# Altium project 8Port_Ethernet.PrjPcb
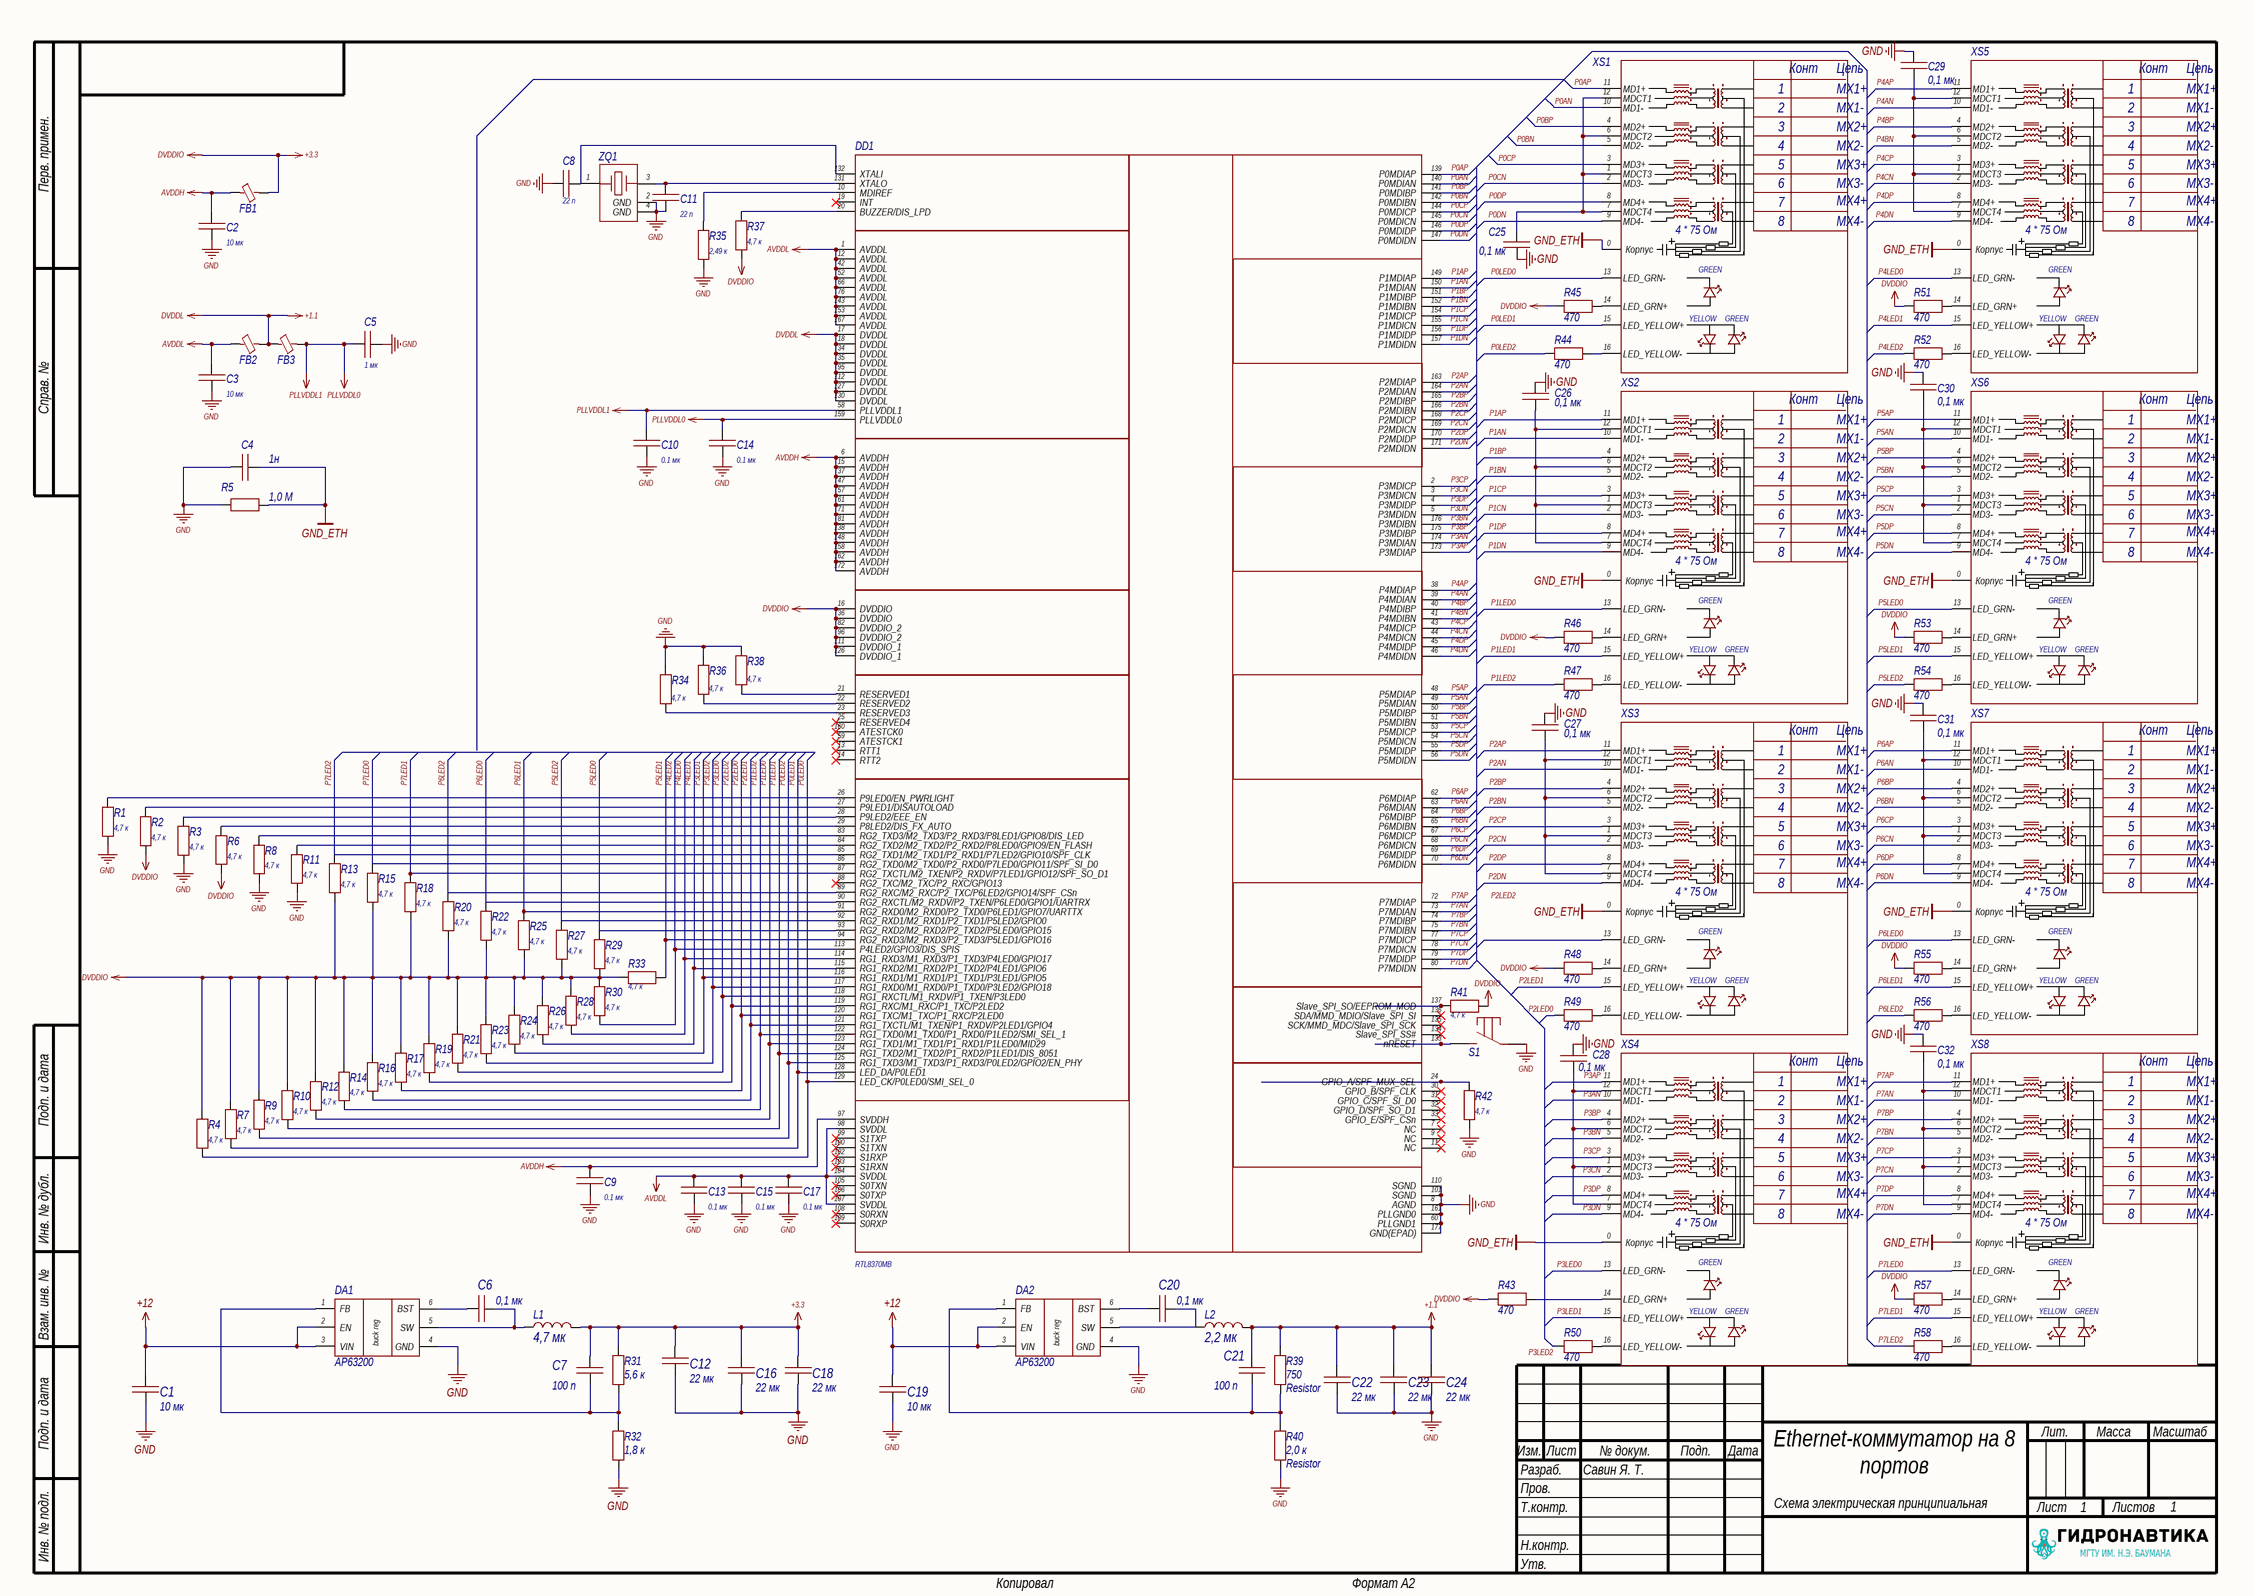
[diagram p0: 8Port.SchDoc]
1 sheet, 108 parts. Net scope: global (net labels, ports and power ports of the same name join across sheets).

## Sheet 8Port.SchDoc: Ethernet-коммутатор на 8 портов
size 594 x 420 mm; DrawnBy: Савин Я. Т.; Address1: Address1; Address2: Address2; Address3: Address3; Address4: Address4; SheetNumber: 1; SheetTotal: 1

### Parts
C1  value 10 мк  [1210C]  (hidden comment: Capacitor)
C2  value 10 мк  [0603C]  (hidden comment: Capacitor)
C3  value 10 мк  [0603C]  (hidden comment: Capacitor)
C4  value 1н  [1210C]  (hidden comment: Capacitor)
C5  value 1 мк  [0603C]  (hidden comment: Capacitor)
C6  value 0,1 мк  [0603C]  (hidden comment: Capacitor)
C7  value 100 п  [0603C]  (hidden comment: Capacitor)
C8  value 22 п  [0603C]  (hidden comment: Capacitor)
C9  value 0.1 мк  [0603C]  (hidden comment: Capacitor)
C10  value 0.1 мк  [0603C]  (hidden comment: Capacitor)
C11  value 22 п  [0603C]  (hidden comment: Capacitor)
C12  value 22 мк  [1210C]  (hidden comment: Capacitor)
C13  value 0.1 мк  [0603C]  (hidden comment: Capacitor)
C14  value 0.1 мк  [0603C]  (hidden comment: Capacitor)
C15  value 0.1 мк  [0603C]  (hidden comment: Capacitor)
C16  value 22 мк  [1210C]  (hidden comment: Capacitor)
C17  value 0.1 мк  [0603C]  (hidden comment: Capacitor)
C18  value 22 мк  [1210C]  (hidden comment: Capacitor)
C19  value 10 мк  [1210C]  (hidden comment: Capacitor)
C20  value 0,1 мк  [0603C]  (hidden comment: Capacitor)
C21  value 100 п  [0603C]  (hidden comment: Capacitor)
C22  value 22 мк  [1210C]  (hidden comment: Capacitor)
C23  value 22 мк  [1210C]  (hidden comment: Capacitor)
C24  value 22 мк  [1210C]  (hidden comment: Capacitor)
C25  value 0,1 мк  [0603C]  (hidden comment: Capacitor)
C26  value 0,1 мк  [0603C]  (hidden comment: Capacitor)
C27  value 0,1 мк  [0603C]  (hidden comment: Capacitor)
C28  value 0,1 мк  [0603C]  (hidden comment: Capacitor)
C29  value 0,1 мк  [0603C]  (hidden comment: Capacitor)
C30  value 0,1 мк  [0603C]  (hidden comment: Capacitor)
C31  value 0,1 мк  [0603C]  (hidden comment: Capacitor)
C32  value 0,1 мк  [0603C]  (hidden comment: Capacitor)
DA1  AP63200  [TSOT26]
DA2  AP63200  [TSOT26]
DD1  RTL8370MB  [QFP40P2200X2200X120-177N]
FB1  BLM18AG102SN1D  [0603L]  (value not drawn)
FB2  BLM18AG102SN1D  [0603L]  (value not drawn)
FB3  BLM18AG102SN1D  [0603L]  (value not drawn)
L1  value 4,7 мк  [B82462G4]  (hidden comment: B82472G6472M)
L2  value 2,2 мк  [CDRH6D12]  (hidden comment: CDRH6D12NP-2R2NC)
R1  value 4,7 к  [0603R]  (hidden comment: Resistor)
R2  value 4,7 к  [0603R]  (hidden comment: Resistor)
R3  value 4,7 к  [0603R]  (hidden comment: Resistor)
R4  value 4,7 к  [0603R]  (hidden comment: Resistor)
R5  value 1,0 М  [0603R]  (hidden comment: Resistor)
R6  value 4,7 к  [0603R]  (hidden comment: Resistor)
R7  value 4,7 к  [0603R]  (hidden comment: Resistor)
R8  value 4,7 к  [0603R]  (hidden comment: Resistor)
R9  value 4,7 к  [0603R]  (hidden comment: Resistor)
R10  value 4,7 к  [0603R]  (hidden comment: Resistor)
R11  value 4,7 к  [0603R]  (hidden comment: Resistor)
R12  value 4,7 к  [0603R]  (hidden comment: Resistor)
R13  value 4,7 к  [0603R]  (hidden comment: Resistor)
R14  value 4,7 к  [0603R]  (hidden comment: Resistor)
R15  value 4,7 к  [0603R]  (hidden comment: Resistor)
R16  value 4,7 к  [0603R]  (hidden comment: Resistor)
R17  value 4,7 к  [0603R]  (hidden comment: Resistor)
R18  value 4,7 к  [0603R]  (hidden comment: Resistor)
R19  value 4,7 к  [0603R]  (hidden comment: Resistor)
R20  value 4,7 к  [0603R]  (hidden comment: Resistor)
R21  value 4,7 к  [0603R]  (hidden comment: Resistor)
R22  value 4,7 к  [0603R]  (hidden comment: Resistor)
R23  value 4,7 к  [0603R]  (hidden comment: Resistor)
R24  value 4,7 к  [0603R]  (hidden comment: Resistor)
R25  value 4,7 к  [0603R]  (hidden comment: Resistor)
R26  value 4,7 к  [0603R]  (hidden comment: Resistor)
R27  value 4,7 к  [0603R]  (hidden comment: Resistor)
R28  value 4,7 к  [0603R]  (hidden comment: Resistor)
R29  value 4,7 к  [0603R]  (hidden comment: Resistor)
R30  value 4,7 к  [0603R]  (hidden comment: Resistor)
R31  value 5,6 к  [0603R]  (hidden comment: Resistor)
R32  value 1,8 к  [0603R]  (hidden comment: Resistor)
R33  value 4,7 к  [0603R]  (hidden comment: Resistor)
R34  value 4,7 к  [0603R]  (hidden comment: Resistor)
R35  value 2,49 к  [0603R]  (hidden comment: Resistor)
R36  value 4,7 к  [0603R]  (hidden comment: Resistor)
R37  value 4,7 к  [0603R]  (hidden comment: Resistor)
R38  value 4,7 к  [0603R]  (hidden comment: Resistor)
R39  Resistor  value 750  [0603R]
R40  Resistor  value 2,0 к  [0603R]
R41  value 4,7 к  [0603R]  (hidden comment: Resistor)
R42  value 4,7 к  [0603R]  (hidden comment: Resistor)
R43  value 470  [0603R]  (hidden comment: Resistor)
R44  value 470  [0603R]  (hidden comment: Resistor)
R45  value 470  [0603R]  (hidden comment: Resistor)
R46  value 470  [0603R]  (hidden comment: Resistor)
R47  value 470  [0603R]  (hidden comment: Resistor)
R48  value 470  [0603R]  (hidden comment: Resistor)
R49  value 470  [0603R]  (hidden comment: Resistor)
R50  value 470  [0603R]  (hidden comment: Resistor)
R51  value 470  [0603R]  (hidden comment: Resistor)
R52  value 470  [0603R]  (hidden comment: Resistor)
R53  value 470  [0603R]  (hidden comment: Resistor)
R54  value 470  [0603R]  (hidden comment: Resistor)
R55  value 470  [0603R]  (hidden comment: Resistor)
R56  value 470  [0603R]  (hidden comment: Resistor)
R57  value 470  [0603R]  (hidden comment: Resistor)
R58  value 470  [0603R]  (hidden comment: Resistor)
S1  Tact_button  [Button_SMD_6x6]  (value not drawn)
XS1  JK0-0136NL  [JK00136NL]  (value not drawn)
XS2  JK0-0136NL  [JK00136NL]  (value not drawn)
XS3  JK0-0136NL  [JK00136NL]  (value not drawn)
XS4  JK0-0136NL  [JK00136NL]  (value not drawn)
XS5  JK0-0136NL  [JK00136NL]  (value not drawn)
XS6  JK0-0136NL  [JK00136NL]  (value not drawn)
XS7  JK0-0136NL  [JK00136NL]  (value not drawn)
XS8  JK0-0136NL  [JK00136NL]  (value not drawn)
ZQ1  X322525MOB4SI  [X322525MOB4SI]  (value not drawn)

### Nets
+1.1: C21.2 C22.2 C23.2 C24.2 DD1.17(DVDDL) DD1.18(DVDDL) DD1.34(DVDDL) DD1.35(DVDDL) DD1.95(DVDDL) DD1.112(DVDDL) DD1.127(DVDDL) DD1.130(DVDDL) FB2.2 FB3.1 L2.3 R39.2  [also labelled DVDDL]
+3.3: C7.2 C12.2 C16.2 C18.2 DD1.16(DVDDIO) DD1.36(DVDDIO) DD1.82(DVDDIO_2) DD1.96(DVDDIO_2) DD1.111(DVDDIO_1) DD1.126(DVDDIO_1) FB1.2 L1.2 R2.2 R4.1 R6.2 R7.1 R9.1 R10.1 R12.1 R13.2 R14.1 R15.2 R16.1 R17.1 R18.2 R19.1 R20.2 R21.1 R22.2 R23.1 R24.1 R25.2 R26.1 R27.2 R28.1 R29.2 R30.1 R31.2 R33.2 R37.1 R41.2 R43.1 R45.1 R46.1 R48.1 R51.1 R53.1 R55.1 R57.1  [also labelled DVDDIO]
+12: C1.2 C19.2 DA1.2(EN) DA1.3(VIN) DA2.2(EN) DA2.3(VIN)
AVDDH: C2.2 C9.1 DD1.6(AVDDH) DD1.15(AVDDH) DD1.37(AVDDH) DD1.47(AVDDH) DD1.57(AVDDH) DD1.61(AVDDH) DD1.71(AVDDH) DD1.81(AVDDH) DD1.97(SVDDH) DD1.138(AVDDH) DD1.148(AVDDH) DD1.158(AVDDH) DD1.162(AVDDH) DD1.172(AVDDH) FB1.1
AVDDL: C3.2 C13.1 C15.1 C17.1 DD1.1(AVDDL) DD1.12(AVDDL) DD1.42(AVDDL) DD1.52(AVDDL) DD1.66(AVDDL) DD1.76(AVDDL) DD1.98(SVDDL) DD1.104(SVDDL) DD1.107(SVDDL) DD1.143(AVDDL) DD1.153(AVDDL) DD1.167(AVDDL) FB2.1
GND: C1.1 C2.1 C3.1 C4.1 C5.1 C8.2 C9.2 C10.2 C11.2 C12.1 C13.2 C14.2 C15.2 C16.1 C17.2 C18.1 C19.1 C22.1 C23.1 C24.1 C25.2 C26.2 C27.2 C28.2 C29.2 C30.2 C31.2 C32.2 DA1.4(GND) DA2.4(GND) DD1.8(AGND) DD1.60(PLLGND1) DD1.101(SGND) DD1.110(SGND) DD1.161(PLLGND0) DD1.177(GND(EPAD)) R1.2 R3.2 R5.1 R8.2 R11.2 R32.1 R34.2 R35.1 R36.2 R38.2 R40.1 R42.2 S1.1 ZQ1.2(GND) ZQ1.4(GND)
GND_ETH: C4.2 R5.2 XS1.0(Корпус) XS2.0(Корпус) XS3.0(Корпус) XS4.0(Корпус) XS5.0(Корпус) XS6.0(Корпус) XS7.0(Корпус) XS8.0(Корпус)
PLLVDDL0: C5.2 C10.1 C14.1 DD1.58(PLLVDDL1) DD1.159(PLLVDDL0) FB3.2  [also labelled PLLVDDL1]
P0AN: DD1.140(P0MDIAN) XS1.10(MD1-)
P0AP: DD1.139(P0MDIAP) XS1.11(MD1+)
P0BN: DD1.142(P0MDIBN) XS1.5(MD2-)
P0BP: DD1.141(P0MDIBP) XS1.4(MD2+)
P0CN: DD1.145(P0MDICN) XS1.2(MD3-)
P0CP: DD1.144(P0MDICP) XS1.3(MD3+)
P0DN: DD1.147(P0MDIDN) XS1.9(MD4-)
P0DP: DD1.146(P0MDIDP) XS1.8(MD4+)
P0LED0: DD1.129(LED_CK/P0LED0/SMI_SEL_0) R4.2 XS1.13(LED_GRN-)
P0LED1: DD1.128(LED_DA/P0LED1) R7.2 XS1.15(LED_YELLOW+)
P0LED2: DD1.125(RG1_TXD3/M1_TXD3/P1_RXD3/P0LED2/GPIO2/EN_PHY) R9.2 R44.1
P1AN: DD1.150(P1MDIAN) XS2.10(MD1-)
P1AP: DD1.149(P1MDIAP) XS2.11(MD1+)
P1BN: DD1.152(P1MDIBN) XS2.5(MD2-)
P1BP: DD1.151(P1MDIBP) XS2.4(MD2+)
P1CN: DD1.155(P1MDICN) XS2.2(MD3-)
P1CP: DD1.154(P1MDICP) XS2.3(MD3+)
P1DN: DD1.157(P1MDIDN) XS2.9(MD4-)
P1DP: DD1.156(P1MDIDP) XS2.8(MD4+)
P1LED0: DD1.123(RG1_TXD1/M1_TXD1/P1_RXD1/P1LED0/MID29) R12.2 XS2.13(LED_GRN-)
P1LED1: DD1.124(RG1_TXD2/M1_TXD2/P1_RXD2/P1LED1/DIS_8051) R10.2 XS2.15(LED_YELLOW+)
P1LED2: DD1.122(RG1_TXD0/M1_TXD0/P1_RXD0/P1LED2/SMI_SEL_1) R14.2 R47.1
P2AN: DD1.164(P2MDIAN) XS3.10(MD1-)
P2AP: DD1.163(P2MDIAP) XS3.11(MD1+)
P2BN: DD1.166(P2MDIBN) XS3.5(MD2-)
P2BP: DD1.165(P2MDIBP) XS3.4(MD2+)
P2CN: DD1.169(P2MDICN) XS3.2(MD3-)
P2CP: DD1.168(P2MDICP) XS3.3(MD3+)
P2DN: DD1.171(P2MDIDN) XS3.9(MD4-)
P2DP: DD1.170(P2MDIDP) XS3.8(MD4+)
P2LED0: DD1.120(RG1_TXC/M1_TXC/P1_RXC/P2LED0) R17.2 R49.1
P2LED1: DD1.121(RG1_TXCTL/M1_TXEN/P1_RXDV/P2LED1/GPIO4) R16.2 XS3.15(LED_YELLOW+)
P2LED2: DD1.119(RG1_RXC/M1_RXC/P1_TXC/P2LED2) R19.2
P3AN: DD1.174(P3MDIAN) XS4.10(MD1-)
P3AP: DD1.173(P3MDIAP) XS4.11(MD1+)
P3BN: DD1.176(P3MDIBN) XS4.5(MD2-)
P3BP: DD1.175(P3MDIBP) XS4.4(MD2+)
P3CN: DD1.3(P3MDICN) XS4.2(MD3-)
P3CP: DD1.2(P3MDICP) XS4.3(MD3+)
P3DN: DD1.5(P3MDIDN) XS4.9(MD4-)
P3DP: DD1.4(P3MDIDP) XS4.8(MD4+)
P3LED0: DD1.118(RG1_RXCTL/M1_RXDV/P1_TXEN/P3LED0) R21.2 XS4.13(LED_GRN-)
P3LED1: DD1.116(RG1_RXD1/M1_RXD1/P1_TXD1/P3LED1/GPIO5) R24.2 XS4.15(LED_YELLOW+)
P3LED2: DD1.117(RG1_RXD0/M1_RXD0/P1_TXD0/P3LED2/GPIO18) R23.2 R50.1
P4AN: DD1.39(P4MDIAN) XS5.10(MD1-)
P4AP: DD1.38(P4MDIAP) XS5.11(MD1+)
P4BN: DD1.41(P4MDIBN) XS5.5(MD2-)
P4BP: DD1.40(P4MDIBP) XS5.4(MD2+)
P4CN: DD1.44(P4MDICN) XS5.2(MD3-)
P4CP: DD1.43(P4MDICP) XS5.3(MD3+)
P4DN: DD1.46(P4MDIDN) XS5.9(MD4-)
P4DP: DD1.45(P4MDIDP) XS5.8(MD4+)
P4LED0: DD1.114(RG1_RXD3/M1_RXD3/P1_TXD3/P4LED0/GPIO17) R28.2 XS5.13(LED_GRN-)
P4LED1: DD1.115(RG1_RXD2/M1_RXD2/P1_TXD2/P4LED1/GPIO6) R26.2 XS5.15(LED_YELLOW+)
P4LED2: DD1.113(P4LED2/GPIO3/DIS_SPIS) R30.2 R52.1
P5AN: DD1.49(P5MDIAN) XS6.10(MD1-)
P5AP: DD1.48(P5MDIAP) XS6.11(MD1+)
P5BN: DD1.51(P5MDIBN) XS6.5(MD2-)
P5BP: DD1.50(P5MDIBP) XS6.4(MD2+)
P5CN: DD1.54(P5MDICN) XS6.2(MD3-)
P5CP: DD1.53(P5MDICP) XS6.3(MD3+)
P5DN: DD1.56(P5MDIDN) XS6.9(MD4-)
P5DP: DD1.55(P5MDIDP) XS6.8(MD4+)
P5LED0: DD1.93(RG2_RXD2/M2_RXD2/P2_TXD2/P5LED0/GPIO15) R29.1 XS6.13(LED_GRN-)
P5LED1: DD1.94(RG2_RXD3/M2_RXD3/P2_TXD3/P5LED1/GPIO16) R33.1 XS6.15(LED_YELLOW+)
P5LED2: DD1.92(RG2_RXD1/M2_RXD1/P2_TXD1/P5LED2/GPIO0) R27.1 R54.1
P6AN: DD1.63(P6MDIAN) XS7.10(MD1-)
P6AP: DD1.62(P6MDIAP) XS7.11(MD1+)
P6BN: DD1.65(P6MDIBN) XS7.5(MD2-)
P6BP: DD1.64(P6MDIBP) XS7.4(MD2+)
P6CN: DD1.68(P6MDICN) XS7.2(MD3-)
P6CP: DD1.67(P6MDICP) XS7.3(MD3+)
P6DN: DD1.70(P6MDIDN) XS7.9(MD4-)
P6DP: DD1.69(P6MDIDP) XS7.8(MD4+)
P6LED0: DD1.90(RG2_RXCTL/M2_RXDV/P2_TXEN/P6LED0/GPIO1/UARTRX) R22.1 XS7.13(LED_GRN-)
P6LED1: DD1.91(RG2_RXD0/M2_RXD0/P2_TXD0/P6LED1/GPIO7/UARTTX) R25.1 XS7.15(LED_YELLOW+)
P6LED2: DD1.89(RG2_RXC/M2_RXC/P2_TXC/P6LED2/GPIO14/SPF_CSn) R20.1 R56.1
P7AN: DD1.73(P7MDIAN) XS8.10(MD1-)
P7AP: DD1.72(P7MDIAP) XS8.11(MD1+)
P7BN: DD1.75(P7MDIBN) XS8.5(MD2-)
P7BP: DD1.74(P7MDIBP) XS8.4(MD2+)
P7CN: DD1.78(P7MDICN) XS8.2(MD3-)
P7CP: DD1.77(P7MDICP) XS8.3(MD3+)
P7DN: DD1.80(P7MDIDN) XS8.9(MD4-)
P7DP: DD1.79(P7MDIDP) XS8.8(MD4+)
P7LED0: DD1.86(RG2_TXD0/M2_TXD0/P2_RXD0/P7LED0/GPIO11/SPF_SI_D0) R15.1 XS8.13(LED_GRN-)
P7LED1: DD1.87(RG2_TXCTL/M2_TXEN/P2_RXDV/P7LED1/GPIO12/SPF_SO_D1) R18.1 XS8.15(LED_YELLOW+)
P7LED2: DD1.85(RG2_TXD1/M2_TXD1/P2_RXD1/P7LED2/GPIO10/SPF_CLK) R13.1 R58.1
NetC6_1: C6.1 DA1.6(BST)
NetC6_2: C6.2 DA1.5(SW) L1.1
NetC7_1: C7.1 DA1.1(FB) R31.1 R32.2
NetC8_1: C8.1 DD1.132(XTALI) ZQ1.1
NetC11_1: C11.1 DD1.131(XTALO) ZQ1.3
NetC20_1: C20.1 DA2.6(BST)
NetC20_2: C20.2 DA2.5(SW) L2.1
NetC21_1: C21.1 DA2.1(FB) R39.1 R40.2
NetC25_1: C25.1 XS1.1(MDCT3) XS1.6(MDCT2) XS1.7(MDCT4) XS1.12(MDCT1)
NetC26_1: C26.1 XS2.1(MDCT3) XS2.6(MDCT2) XS2.7(MDCT4) XS2.12(MDCT1)
NetC27_1: C27.1 XS3.1(MDCT3) XS3.6(MDCT2) XS3.7(MDCT4) XS3.12(MDCT1)
NetC28_1: C28.1 XS4.1(MDCT3) XS4.6(MDCT2) XS4.7(MDCT4) XS4.12(MDCT1)
NetC29_1: C29.1 XS5.1(MDCT3) XS5.6(MDCT2) XS5.7(MDCT4) XS5.12(MDCT1)
NetC30_1: C30.1 XS6.1(MDCT3) XS6.6(MDCT2) XS6.7(MDCT4) XS6.12(MDCT1)
NetC31_1: C31.1 XS7.1(MDCT3) XS7.6(MDCT2) XS7.7(MDCT4) XS7.12(MDCT1)
NetC32_1: C32.1 XS8.1(MDCT3) XS8.6(MDCT2) XS8.7(MDCT4) XS8.12(MDCT1)
NetDD1_10: DD1.10(MDIREF) R35.2
NetDD1_20: DD1.20(BUZZER/DIS_LPD) R37.2
NetDD1_21: DD1.21(RESERVED1) R38.1
NetDD1_22: DD1.22(RESERVED2) R36.1
NetDD1_23: DD1.23(RESERVED3) R34.1
NetDD1_24: DD1.24(GPIO_A/SPF_MUX_SEL) R42.1
NetDD1_26: DD1.26(P9LED0/EN_PWRLIGHT) R1.1
NetDD1_27: DD1.27(P9LED1/DISAUTOLOAD) R2.1
NetDD1_28: DD1.28(P9LED2/EEE_EN) R3.1
NetDD1_29: DD1.29(P8LED2/DIS_FX_AUTO) R6.1
NetDD1_83: DD1.83(RG2_TXD3/M2_TXD3/P2_RXD3/P8LED1/GPIO8/DIS_LED) R8.1
NetDD1_84: DD1.84(RG2_TXD2/M2_TXD2/P2_RXD2/P8LED0/GPIO9/EN_FLASH) R11.1
NetDD1_133: DD1.133(nRESET) S1.2
NetDD1_137: DD1.137(Slave_SPI_SO/EEPROM_MOD) R41.1
NetR43_2: R43.2 XS4.14(LED_GRN+)
NetR44_2: R44.2 XS1.16(LED_YELLOW-)
NetR45_2: R45.2 XS1.14(LED_GRN+)
NetR46_2: R46.2 XS2.14(LED_GRN+)
NetR47_2: R47.2 XS2.16(LED_YELLOW-)
NetR48_2: R48.2 XS3.14(LED_GRN+)
NetR49_2: R49.2 XS3.16(LED_YELLOW-)
NetR50_2: R50.2 XS4.16(LED_YELLOW-)
NetR51_2: R51.2 XS5.14(LED_GRN+)
NetR52_2: R52.2 XS5.16(LED_YELLOW-)
NetR53_2: R53.2 XS6.14(LED_GRN+)
NetR54_2: R54.2 XS6.16(LED_YELLOW-)
NetR55_2: R55.2 XS7.14(LED_GRN+)
NetR56_2: R56.2 XS7.16(LED_YELLOW-)
NetR57_2: R57.2 XS8.14(LED_GRN+)
NetR58_2: R58.2 XS8.16(LED_YELLOW-)

Not connected (* = marked no-connect by the designer): DD1 7(NC)* 9(NC)* 11(NC)* 13(RTT1)* 14(RTT2)* 19(INT)* 25(RESERVED4)* 30(GPIO_B/SPF_CLK)* 31(GPIO_C/SPF_SI_D0)* 32(GPIO_D/SPF_SO_D1)* 33(GPIO_E/SPF_CSn)* 59(ATESTCK1)* 88(RG2_TXC/M2_TXC/P2_RXC/GPIO13)* 99(S1TXP)* 100(S1TXN)* 102(S1RXP)* 103(S1RXN)* 105(S0TXN)* 106(S0TXP)* 108(S0RXN)* 109(S0RXP)* 134(Slave_SPI_SS#)* 135(SCK/MMD_MDC/Slave_SPI_SCK)* 136(SDA/MMD_MDIO/Slave_SPI_SI)* 160(ATESTCK0)*; XS3 13(LED_GRN-)

### Notes on the sheet
- Labels drawn without touching a wire or pin: P2LED2
- Перв. примен.
- Справ. №
- Подп. и дата
- Инв. № дубл.
- Взам. инв. №
- Разраб.
- Изм.
- Лист
- № докум.
- Подп.
- Дата
- Лит.
- Масса
- Масштаб
- Пров.
- Т.контр.
- Схема электрическая принципиальная
- Листов
- Инв. № подл.
- Утв.
- Н.контр.
- Копировал
- Формат А2
- (in symbol AP63200) buck reg
- (in symbol JK0-0136NL) Конт; Цепь; MX1+; MX1-; MX2+; MX2-; MX3+; MX3-; MX4+; MX4-; 4 * 75 Ом; GREEN; YELLOW

### Library data of the parts
C1 C19 = Capacitor_10u_10_35V_X7R_1210C: Конденсатор 1210C ёмкостью 10 мк 10%, 35 В, X7R; Voltage (V): 35; Capacity (nF): 10000; Part Number: Capacitor_10u_10_35V_X7R_1210C; Tolerance: 10%; Dielectric: X7R
C2 C3 C5 C8-C11 C13-C15 C17 = 0,1 мк: Конденсатор; Part Number: Capacitor
C4 = Capacitor_1n_10_1000V_X7R_1206C: Конденсатор 1210C ёмкостью 1н 10%, 1000 В, X7R; Voltage (V): 1000; Capacity (nF): 1; Автор: rreali; Datasheet: https://static.chipdip.ru/lib/245/DOC027245978.pdf; Part Number: Capacitor_1n_10_1000V_X7R_1206C; Tolerance: 10%; Dielectric: X7R
C6 C20 = Capacitor_0,1u_10_50V_X7R_0603C: Конденсатор 0603C ёмкостью 0,1 мк 10%, 50 В, X7R; Voltage (V): 50; Capacity (nF): 100; Part Number: Capacitor_0,1u_10_50V_X7R_0603C; Tolerance: 10%; Dielectric: X7R
C7 C21 = Capacitor_100p_10_50V_X7R_0603C: Конденсатор 0603C ёмкостью 100 п 10%, 50 В, X7R; Voltage (V): 50; Capacity (nF): 0,1; Part Number: Capacitor_100p_10_50V_X7R_0603C; Tolerance: 10%; Dielectric: X7R
C12 C16 C18 C22-C24 = Capacitor_22u_10_25V_X7R_1210C: Конденсатор 1210C ёмкостью 22 мк 10%, 25 В, X7R; Voltage (V): 25; Capacity (nF): 22000; Part Number: Capacitor_22u_10_25V_X7R_1210C; Tolerance: 10%; Dielectric: X7R
C25-C32 = Capacitor_0,1u_10_50V_X7R_0603C: Конденсатор 0603C ёмкостью 0,1 мк 10%, 50 В, X7R; Library Path2: Schematic\Capacitor.SchLib; Voltage (V): 50; Capacity (nF): 100; Part Number: Capacitor_0,1u_10_50V_X7R_0603C; Tolerance: 10%; Dielectric: X7R
DA1 DA2 = AP63200: DC-DC понижающий преобразователь, Vin: 3.8 - 40 В, adj, 2 А; Part Number: AP63200
FB1-FB3 = BLM18AG102SN1D: Дроссель подавления ЭМП; Автор: glebmih; Part Number: BLM18AG102SN1D; Datasheet: https://www.chipdip.ru/product/blm18ag102sn1d-1-kom-0.4a-0603-drossel-podavleniya-murata-9000029220
L1 = B82472G6472M: Индуктивность на 4,7 мкГн, номинальный ток 2,5 А; Inductance (μH): 4,7; Current: 2,5 А; Автор: rreali; Part Number: B82472G6472M
L2 = CDRH6D12NP-2R2NC: Индуктивность на 2,2 мкГн, номинальный ток 2,5 А; Inductance (μH): 2,2; Current: 2,5 А; Автор: rreali; Part Number: CDRH6D12NP-2R2NC
R1-R4 R6-R30 R33-R38 R41 R42 = Resistor_4.7k_1_0603: Резистор номиналом 4,7 кОм 1%; Power: *; Part Number: Resistor_4.7k_1_0603; Tolerance: 1%
R5 = Resistor_1.0M_1_0603: Резистор номиналом 1,0 МОм 1%; Power: *; Part Number: Resistor_1.0M_1_0603; Tolerance: 1%
R31 = Resistor_5.6k_1_0603: Резистор номиналом 5,6 кОм 1%; Power: *; Part Number: Resistor_5.6k_1_0603; Tolerance: 1%
R32 = Resistor_1.8k_1_0603: Резистор номиналом 1,8 кОм 1%; Power: *; Part Number: Resistor_1.8k_1_0603; Tolerance: 1%
R39 = Resistor_750_1_0603: Резистор номиналом 750 Ом 1%; Power: *; Part Number: Resistor_750_1_0603; Tolerance: 1%
R40 = Resistor_2.0k_1_0603: Резистор номиналом 2,0 кОм 1%; Power: *; Part Number: Resistor_2.0k_1_0603; Tolerance: 1%
R43-R58 = Resistor_470_1_0603: Резистор номиналом 470 Ом 1%; Power: *; Part Number: Resistor_470_1_0603; Tolerance: 1%
S1 = Tact_button: Тактовая кнопка; Part Number: Tact_button
XS1-XS8 = JK0-0136NL: Модульный разъем (с трансформатором) Cat5/6, RJ45, Гнездо,  1 порт; MF: Pulse Electronics; System: Connector; Автор: rreali; Mouser-Purchase-URL: https://snapeda.com/shop?store=Mouser&id=195579; Package: None; MP: JK0-0136NL; DigiKey-Purchase-URL: https://snapeda.com/shop?store=DigiKey&id=195579; Value: *; SnapEDA_Link: https://www.snapeda.com/parts/JK0-0136NL/Pulse%20Electronics%20Network/view-part/195579/?ref=snap; Price: None; Availability: Good; Part Number: JK0-0136NL; Datasheet: https://static.chipdip.ru/lib/746/DOC044746386.pdf
ZQ1 = X322525MOB4SI: Кварцевый резонатор SMD 25 МГц ±10ppm SMD-3225_4P; Value: 25 МГц; Автор: rreali; Part Number: X322525MOB4SI; Datasheet: https://datasheet.lcsc.com/lcsc/Yangxing-Tech-X322525MOB4SI_C9006.pdf